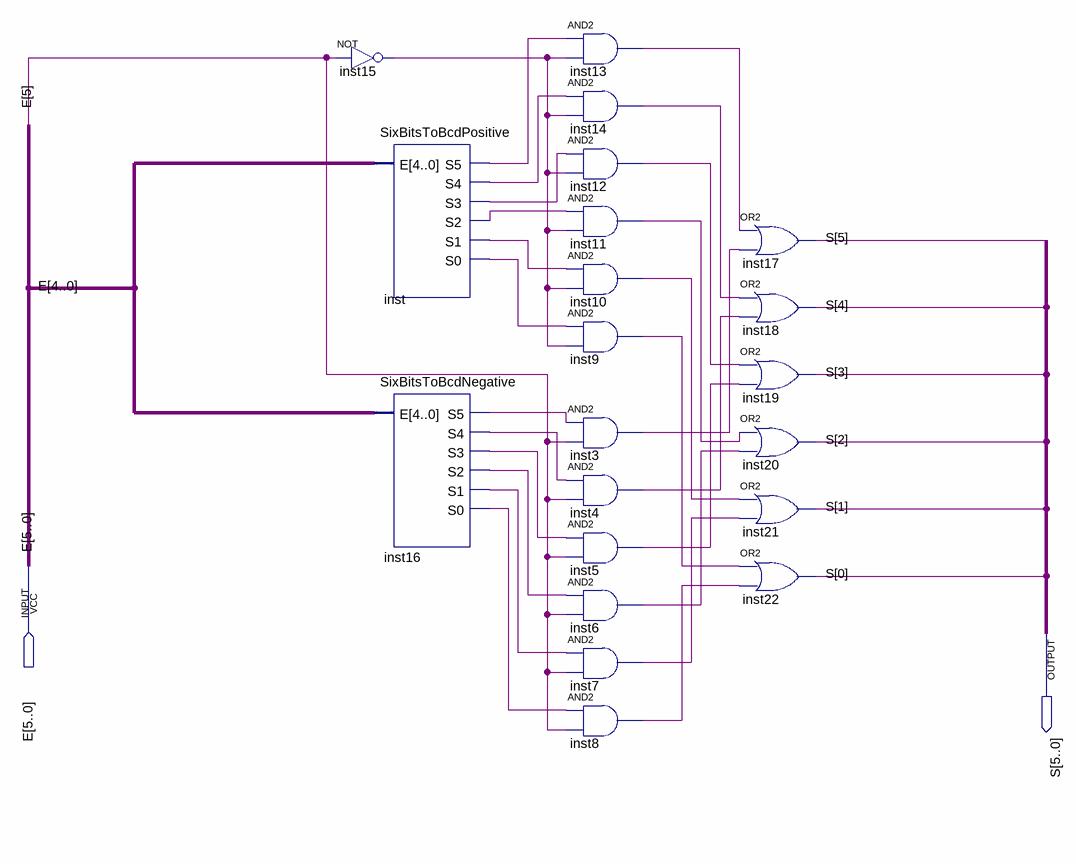
[diagram p0: schematic sheet]
// Quartus schematic SixBitsToBcdMain.bdf as structural Verilog: 21 symbols, 2 pins
module SixBitsToBcdMain (
  input  [5:0] E,
  output [5:0] S
);

  wire inst3_out, inst4_out, inst5_out, inst6_out, inst7_out, inst8_out, inst9_out, inst10_out, inst11_out,
       inst12_out, inst13_out, inst14_out, inst15_out, inst16_s0, inst16_s1, inst16_s2, inst16_s3, inst16_s4,
       inst16_s5, inst_s0, inst_s1, inst_s2, inst_s3, inst_s4, inst_s5;

  not inst15 (inst15_out, E[5]);
  SixBitsToBcdPositive inst (
    .E(E[4:0]), .S5(inst_s5), .S4(inst_s4), .S3(inst_s3), .S2(inst_s2), .S1(inst_s1), .S0(inst_s0));
  SixBitsToBcdNegative inst16 (
    .E(E[4:0]), .S5(inst16_s5), .S4(inst16_s4), .S3(inst16_s3), .S2(inst16_s2), .S1(inst16_s1), .S0(inst16_s0));
  and inst13 (inst13_out, inst_s5, inst15_out);
  and inst14 (inst14_out, inst_s4, inst15_out);
  and inst12 (inst12_out, inst_s3, inst15_out);
  and inst11 (inst11_out, inst_s2, inst15_out);
  and inst10 (inst10_out, inst_s1, inst15_out);
  and inst9 (inst9_out, inst_s0, inst15_out);
  and inst3 (inst3_out, inst16_s5, E[5]);
  and inst4 (inst4_out, inst16_s4, E[5]);
  and inst5 (inst5_out, inst16_s3, E[5]);
  and inst6 (inst6_out, inst16_s2, E[5]);
  and inst7 (inst7_out, inst16_s1, E[5]);
  and inst8 (inst8_out, inst16_s0, E[5]);
  or inst17 (S[5], inst13_out, inst3_out);
  or inst18 (S[4], inst14_out, inst4_out);
  or inst19 (S[3], inst12_out, inst5_out);
  or inst20 (S[2], inst11_out, inst6_out);
  or inst21 (S[1], inst10_out, inst7_out);
  or inst22 (S[0], inst9_out, inst8_out);
endmodule
